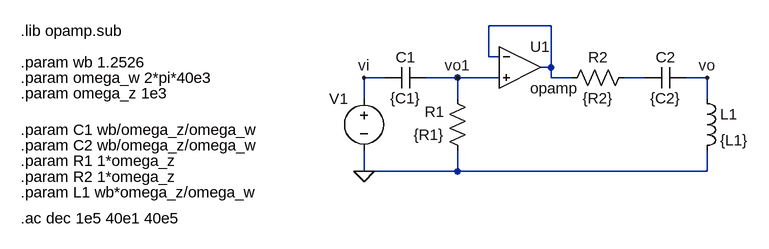
[diagram p0: schematic circ_pasivo.asc]
circ_pasivo.asc, the LTspice schematic file:
Version 4
SHEET 1 1848 680
WIRE 1536 112 1440 112
WIRE 1440 160 1440 112
WIRE 1456 160 1440 160
WIRE 1536 176 1536 112
WIRE 1536 176 1520 176
WIRE 1280 192 1248 192
WIRE 1392 192 1344 192
WIRE 1456 192 1392 192
WIRE 1536 192 1536 176
WIRE 1568 192 1536 192
WIRE 1680 192 1648 192
WIRE 1776 192 1744 192
WIRE 1248 224 1248 192
WIRE 1392 224 1392 192
WIRE 1776 224 1776 192
WIRE 1248 336 1248 304
WIRE 1392 336 1392 304
WIRE 1392 336 1248 336
WIRE 1776 336 1776 304
WIRE 1776 336 1392 336
FLAG 1248 336 0
FLAG 1776 192 vo
FLAG 1248 192 vi
FLAG 1392 192 vo1
SYMBOL res 1408 320 R180
WINDOW 0 36 76 Left 2
WINDOW 3 36 40 Left 2
SYMATTR InstName R1
SYMATTR Value {R1}
SYMBOL cap 1344 176 R90
WINDOW 0 0 32 VBottom 2
WINDOW 3 32 32 VTop 2
SYMATTR InstName C1
SYMATTR Value {C1}
SYMBOL cap 1744 176 R90
WINDOW 0 0 32 VBottom 2
WINDOW 3 32 32 VTop 2
SYMATTR InstName C2
SYMATTR Value {C2}
SYMBOL res 1664 176 R90
WINDOW 0 0 56 VBottom 2
WINDOW 3 32 56 VTop 2
SYMATTR InstName R2
SYMATTR Value {R2}
SYMBOL ind 1760 208 R0
SYMATTR InstName L1
SYMATTR Value {L1}
SYMBOL opamp 1488 112 R0
SYMATTR InstName U1
SYMBOL voltage 1248 208 M0
SYMATTR InstName V1
SYMATTR Value ""
SYMATTR Value2 AC 1
TEXT 720 168 Left 2 !.param wb 1.2526
TEXT 720 120 Left 2 !.lib opamp.sub
TEXT 720 272 Left 2 !.param C1 wb/omega_z/omega_w
TEXT 720 296 Left 2 !.param C2 wb/omega_z/omega_w
TEXT 720 320 Left 2 !.param R1 1*omega_z
TEXT 720 344 Left 2 !.param R2 1*omega_z
TEXT 720 368 Left 2 !.param L1 wb*omega_z/omega_w
TEXT 720 408 Left 2 !.ac dec 1e5 40e1 40e5
TEXT 720 192 Left 2 !.param omega_w 2*pi*40e3
TEXT 720 216 Left 2 !.param omega_z 1e3

The netlist it stands for:
* circ_pasivo.asc
R1 0 vo1 {R1}
C1 vo1 vi {C1}
C2 vo N002 {C2}
R2 N002 N001 {R2}
L1 vo 0 {L1}
XU1 N001 vo1 N001 opamp Aol=100K GBW=10Meg  ; pins invin noninvin out
V1 vi 0 AC 1
.param wb 1.2526
.lib opamp.sub
.param C1 wb/omega_z/omega_w
.param C2 wb/omega_z/omega_w
.param R1 1*omega_z
.param R2 1*omega_z
.param L1 wb*omega_z/omega_w
.ac dec 1e5 40e1 40e5
.param omega_w 2*pi*40e3
.param omega_z 1e3
.backanno
.end